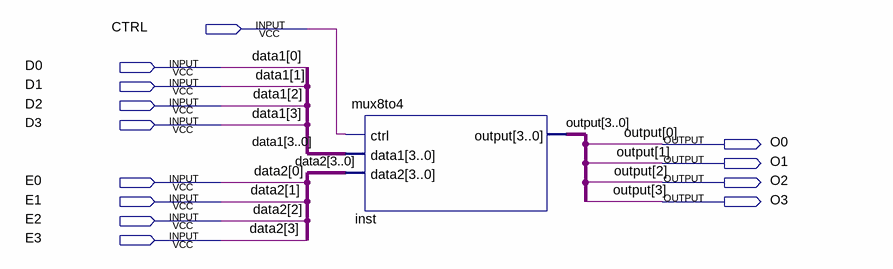
[diagram p0: schematic sheet]
// Quartus schematic TMP.bdf as structural Verilog: 1 symbols, 13 pins
module TMP (
  input  CTRL,
  input  D0,
  input  D1,
  input  D2,
  input  D3,
  input  E0,
  input  E1,
  input  E2,
  input  E3,
  output O0,
  output O1,
  output O2,
  output O3
);

  mux8to4 inst (.ctrl(CTRL), .data1({D3, D2, D1, D0}), .data2({E3, E2, E1, E0}), .\output ({O3, O2, O1, O0}));

  // Other names for the same wires on the sheet: data1[3:0] = {D3, D2, D1, D0}; data2[3:0] = {E3, E2, E1, E0};
  //   output[3:0] = {O3, O2, O1, O0}
endmodule
